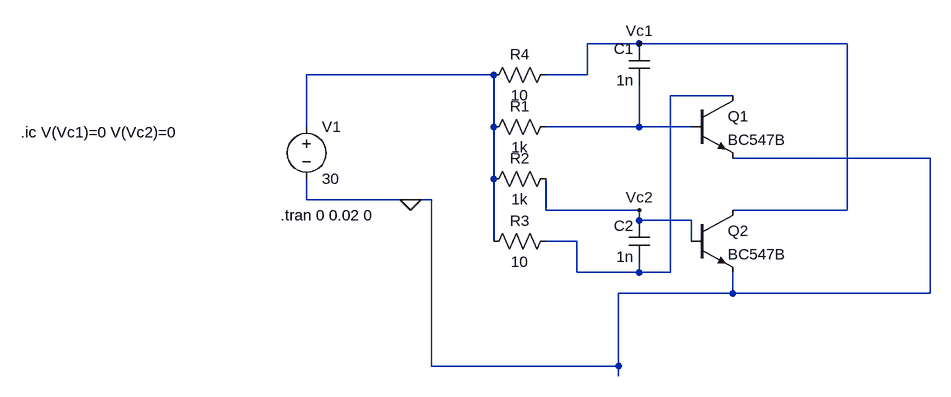
[diagram p0: schematic bc547 led switcher.asc]
bc547 led switcher.asc, the LTspice schematic file:
Version 4
SHEET 1 1144 680
WIRE 560 0 480 0
WIRE 880 0 560 0
WIRE 336 48 48 48
WIRE 480 48 480 0
WIRE 480 48 416 48
WIRE 704 80 608 80
WIRE 48 128 48 48
WIRE 336 128 336 48
WIRE 560 128 560 64
WIRE 560 128 416 128
WIRE 640 128 560 128
WIRE 1008 176 704 176
WIRE 336 208 336 128
WIRE 48 240 48 208
WIRE 208 240 48 240
WIRE 240 240 208 240
WIRE 416 256 416 208
WIRE 560 256 416 256
WIRE 880 256 880 0
WIRE 880 256 704 256
WIRE 560 272 560 256
WIRE 640 272 560 272
WIRE 336 304 336 208
WIRE 464 304 416 304
WIRE 640 304 640 272
WIRE 464 352 464 304
WIRE 560 352 560 336
WIRE 560 352 464 352
WIRE 608 352 608 80
WIRE 608 352 560 352
WIRE 704 384 704 352
WIRE 704 384 528 384
WIRE 1008 384 1008 176
WIRE 1008 384 704 384
WIRE 240 496 240 240
WIRE 528 496 528 384
WIRE 528 496 240 496
WIRE 528 512 528 496
FLAG 208 240 0
FLAG 560 0 Vc1
FLAG 560 256 Vc2
SYMBOL voltage 48 112 R0
WINDOW 123 0 0 Left 0
WINDOW 39 0 0 Left 0
SYMATTR InstName V1
SYMATTR Value 30
SYMBOL npn 640 80 R0
SYMATTR InstName Q1
SYMATTR Value BC547B
SYMBOL cap 576 64 R180
WINDOW 0 24 56 Left 2
WINDOW 3 24 8 Left 2
SYMATTR InstName C1
SYMATTR Value 1n
SYMBOL res 432 32 R90
WINDOW 0 0 56 VBottom 2
WINDOW 3 32 56 VTop 2
SYMATTR InstName R4
SYMATTR Value 10
SYMBOL res 432 112 R90
WINDOW 0 0 56 VBottom 2
WINDOW 3 32 56 VTop 2
SYMATTR InstName R1
SYMATTR Value 1k
SYMBOL res 432 192 R90
WINDOW 0 0 56 VBottom 2
WINDOW 3 32 56 VTop 2
SYMATTR InstName R2
SYMATTR Value 1k
SYMBOL res 432 288 R90
WINDOW 0 0 56 VBottom 2
WINDOW 3 32 56 VTop 2
SYMATTR InstName R3
SYMATTR Value 10
SYMBOL npn 640 256 R0
SYMATTR InstName Q2
SYMATTR Value BC547B
SYMBOL cap 576 336 R180
WINDOW 0 24 56 Left 2
WINDOW 3 24 8 Left 2
SYMATTR InstName C2
SYMATTR Value 1n
TEXT 8 264 Left 2 !.tran 0 0.02 0
TEXT -392 136 Left 2 !.ic V(Vc1)=0 V(Vc2)=0

The netlist it stands for:
* bc547 led switcher.asc
V1 N001 0 30
Q1 N002 N003 0 0 BC547B
C1 N003 Vc1 1n
R4 Vc1 N001 10
R1 N003 N001 1k
R2 Vc2 N001 1k
R3 N002 N001 10
Q2 Vc1 Vc2 0 0 BC547B
C2 N002 Vc2 1n
.model NPN NPN
.model PNP PNP
.lib standard.bjt
.tran 0 0.02 0
.ic V(Vc1)=0 V(Vc2)=0
.backanno
.end